# Altium project fNIRS_ECU.PrjPcb (part 3 of 3)
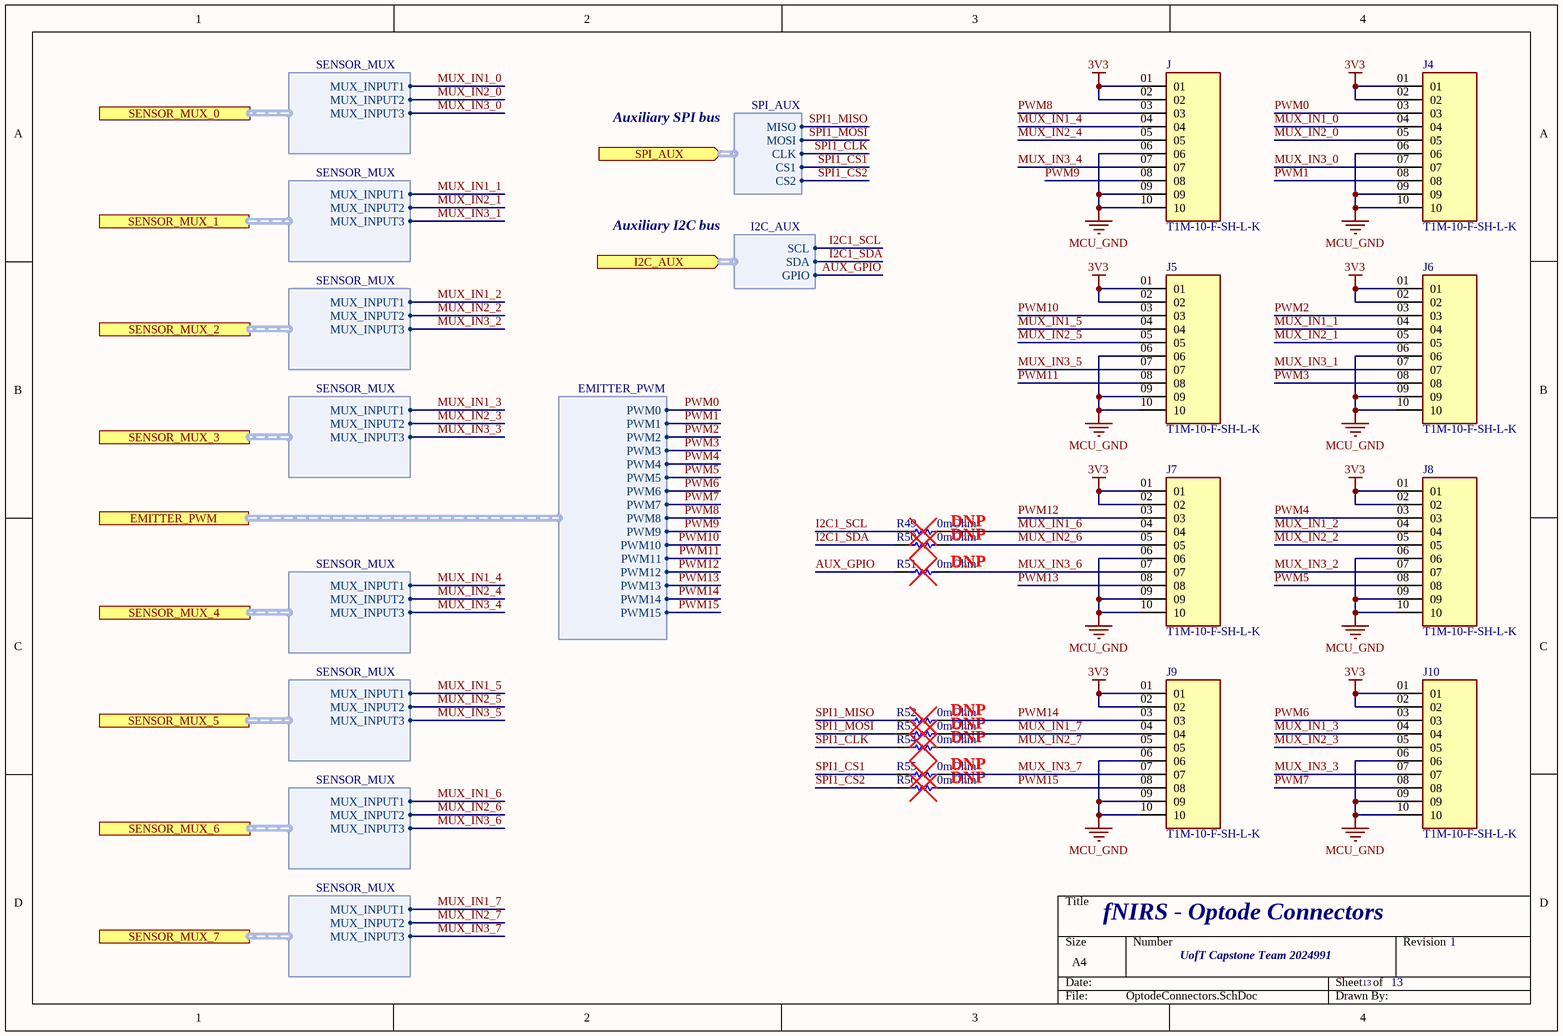
[diagram p13: OptodeConnectors.SchDoc]

## Nets that join several sheets
3V3: OptodeControl (6 pins), U_Sensing/U_AnalogMux (C21_U_Sensing_U_AnalogMux#1.1 U5_U_Sensing_U_AnalogMux#1.6), U_Sensing/U_AnalogMux (C21_U_Sensing_U_AnalogMux#2.1 U5_U_Sensing_U_AnalogMux#2.6), U_Sensing/U_AnalogMux (C21_U_Sensing_U_AnalogMux#3.1 U5_U_Sensing_U_AnalogMux#3.6), U_Sensing/U_AnalogMux (C21_U_Sensing_U_AnalogMux#4.1 U5_U_Sensing_U_AnalogMux#4.6), U_Sensing/U_AnalogMux (C21_U_Sensing_U_AnalogMux#5.1 U5_U_Sensing_U_AnalogMux#5.6), U_Sensing/U_AnalogMux (C21_U_Sensing_U_AnalogMux#6.1 U5_U_Sensing_U_AnalogMux#6.6), U_Sensing/U_AnalogMux (C21_U_Sensing_U_AnalogMux#7.1 U5_U_Sensing_U_AnalogMux#7.6), U_Sensing/U_AnalogMux (C21_U_Sensing_U_AnalogMux#8.1 U5_U_Sensing_U_AnalogMux#8.6), U_Sensing/U_Buffer (C22_U_Sensing_U_Buffer#1.2 U6_U_Sensing_U_Buffer#1.4), U_Sensing/U_Buffer (C22_U_Sensing_U_Buffer#2.2 U6_U_Sensing_U_Buffer#2.4), U_Sensing/U_Buffer (C22_U_Sensing_U_Buffer#3.2 U6_U_Sensing_U_Buffer#3.4), TemperatureSense (R41.2 R42.2 R45.2), Power (C18.1 U3.2 U3.4), MCU (17 pins), U_MCU/U_GPIO_Expander (5 pins), U_MCU/U_GPIO_Expander (5 pins), SD_Card (9 pins), USBInterface (5 pins), Connectors (J3.3), OptodeConnectors (16 pins)
5V_USB: Power (C15.1 U2.1), USBInterface (D2.4 U8.1), Connectors (J2.1)
MCU_GND: OptodeControl (9 pins), U_Sensing/U_AnalogMux (C21_U_Sensing_U_AnalogMux#1.2 U5_U_Sensing_U_AnalogMux#1.3), U_Sensing/U_AnalogMux (C21_U_Sensing_U_AnalogMux#2.2 U5_U_Sensing_U_AnalogMux#2.3), U_Sensing/U_AnalogMux (C21_U_Sensing_U_AnalogMux#3.2 U5_U_Sensing_U_AnalogMux#3.3), U_Sensing/U_AnalogMux (C21_U_Sensing_U_AnalogMux#4.2 U5_U_Sensing_U_AnalogMux#4.3), U_Sensing/U_AnalogMux (C21_U_Sensing_U_AnalogMux#5.2 U5_U_Sensing_U_AnalogMux#5.3), U_Sensing/U_AnalogMux (C21_U_Sensing_U_AnalogMux#6.2 U5_U_Sensing_U_AnalogMux#6.3), U_Sensing/U_AnalogMux (C21_U_Sensing_U_AnalogMux#7.2 U5_U_Sensing_U_AnalogMux#7.3), U_Sensing/U_AnalogMux (C21_U_Sensing_U_AnalogMux#8.2 U5_U_Sensing_U_AnalogMux#8.3), U_Sensing/U_Buffer (6 pins), U_Sensing/U_Buffer (6 pins), U_Sensing/U_Buffer (6 pins), TemperatureSense (6 pins), Power (11 pins), MCU (27 pins), U_MCU/U_GPIO_Expander (5 pins), U_MCU/U_GPIO_Expander (5 pins), SD_Card (12 pins), USBInterface (C29.2 U8.9 U8.15), Connectors (J3.5 J3.7), OptodeConnectors (24 pins)
USB_GND: Power (C15.2 U2.2 U2.3), USBInterface (C28.2 D2.1 U8.2 U8.8), Connectors (J2.5)
ADC12_IN6: U_Sensing/U_Buffer (C26_U_Sensing_U_Buffer#3.2 R19_U_Sensing_U_Buffer#3.2), MCU (U1.15)
ADC12_IN7: U_Sensing/U_Buffer (C25_U_Sensing_U_Buffer#3.2 R20_U_Sensing_U_Buffer#3.2), MCU (U1.16)
ADC12_IN8: U_Sensing/U_Buffer (C24_U_Sensing_U_Buffer#3.2 R21_U_Sensing_U_Buffer#3.2), MCU (U1.17)
ADC12_IN9: U_Sensing/U_Buffer (C23_U_Sensing_U_Buffer#3.2 R22_U_Sensing_U_Buffer#3.2), MCU (U1.20)
ADC12_IN12: U_Sensing/U_Buffer (C23_U_Sensing_U_Buffer#1.2 R22_U_Sensing_U_Buffer#1.2), MCU (U1.23)
ADC12_IN13: U_Sensing/U_Buffer (C24_U_Sensing_U_Buffer#1.2 R21_U_Sensing_U_Buffer#1.2), MCU (U1.24)
ADC12_IN14: U_Sensing/U_Buffer (C25_U_Sensing_U_Buffer#1.2 R20_U_Sensing_U_Buffer#1.2), MCU (U1.25)
ADC12_IN15: U_Sensing/U_Buffer (C26_U_Sensing_U_Buffer#1.2 R19_U_Sensing_U_Buffer#1.2), MCU (U1.26)
ADC123_IN1: U_Sensing/U_Buffer (C24_U_Sensing_U_Buffer#2.2 R21_U_Sensing_U_Buffer#2.2), MCU (U1.8)
ADC123_IN2: U_Sensing/U_Buffer (C23_U_Sensing_U_Buffer#2.2 R22_U_Sensing_U_Buffer#2.2), MCU (U1.9)
ADC123_IN3: U_Sensing/U_Buffer (C25_U_Sensing_U_Buffer#2.2 R20_U_Sensing_U_Buffer#2.2), MCU (U1.10)
ADC123_IN4: U_Sensing/U_Buffer (C26_U_Sensing_U_Buffer#2.2 R19_U_Sensing_U_Buffer#2.2), MCU (U1.11)
AMBIENT_TEMP: U_Sensing/U_Buffer (U6_U_Sensing_U_Buffer#3.12), TemperatureSense (C33.1 R45.1 R46.2)
AUX_GPIO: MCU (U1.33), OptodeConnectors (R51.2)
BATTERY_TEMP: U_Sensing/U_Buffer (U6_U_Sensing_U_Buffer#3.10), TemperatureSense (C31.1 R41.1 R43.2)
CARD_DETECT: MCU (U1.2), SD_Card (C14.1 R15.1 R17.2 SD1.9)
GPIO_EX1_P1_4: MCU (TP15.1), U_MCU/U_GPIO_Expander (U7_U_MCU_U_GPIO_Expander#2.17)
GPIO_EX1_P1_5: MCU (TP16.1), U_MCU/U_GPIO_Expander (U7_U_MCU_U_GPIO_Expander#2.18)
GPIO_EX1_P1_6: MCU (TP17.1), U_MCU/U_GPIO_Expander (U7_U_MCU_U_GPIO_Expander#2.19)
GPIO_EX1_P1_7: MCU (TP18.1), U_MCU/U_GPIO_Expander (U7_U_MCU_U_GPIO_Expander#2.20)
GPIO_EX2_P1_4: MCU (TP19.1), U_MCU/U_GPIO_Expander (U7_U_MCU_U_GPIO_Expander#1.17)
GPIO_EX2_P1_5: MCU (TP20.1), U_MCU/U_GPIO_Expander (U7_U_MCU_U_GPIO_Expander#1.18)
GPIO_EX2_P1_6: MCU (TP21.1), U_MCU/U_GPIO_Expander (U7_U_MCU_U_GPIO_Expander#1.19)
GPIO_EX2_P1_7: MCU (TP22.1), U_MCU/U_GPIO_Expander (U7_U_MCU_U_GPIO_Expander#1.20)
GPIO_P0_0: U_Sensing/U_AnalogMux (U5_U_Sensing_U_AnalogMux#2.1), U_MCU/U_GPIO_Expander (U7_U_MCU_U_GPIO_Expander#2.4)
GPIO_P0_0: U_Sensing/U_AnalogMux (U5_U_Sensing_U_AnalogMux#3.1), U_MCU/U_GPIO_Expander (U7_U_MCU_U_GPIO_Expander#1.4)
GPIO_P0_1: U_Sensing/U_AnalogMux (U5_U_Sensing_U_AnalogMux#2.10), U_MCU/U_GPIO_Expander (U7_U_MCU_U_GPIO_Expander#2.5)
GPIO_P0_1: U_Sensing/U_AnalogMux (U5_U_Sensing_U_AnalogMux#3.10), U_MCU/U_GPIO_Expander (U7_U_MCU_U_GPIO_Expander#1.5)
GPIO_P0_2: U_Sensing/U_AnalogMux (U5_U_Sensing_U_AnalogMux#2.5), U_MCU/U_GPIO_Expander (U7_U_MCU_U_GPIO_Expander#2.6)
GPIO_P0_2: U_Sensing/U_AnalogMux (U5_U_Sensing_U_AnalogMux#3.5), U_MCU/U_GPIO_Expander (U7_U_MCU_U_GPIO_Expander#1.6)
GPIO_P0_3: U_Sensing/U_AnalogMux (U5_U_Sensing_U_AnalogMux#6.1), U_MCU/U_GPIO_Expander (U7_U_MCU_U_GPIO_Expander#2.7)
GPIO_P0_3: U_Sensing/U_AnalogMux (U5_U_Sensing_U_AnalogMux#7.1), U_MCU/U_GPIO_Expander (U7_U_MCU_U_GPIO_Expander#1.7)
GPIO_P0_4: U_Sensing/U_AnalogMux (U5_U_Sensing_U_AnalogMux#6.10), U_MCU/U_GPIO_Expander (U7_U_MCU_U_GPIO_Expander#2.8)
GPIO_P0_4: U_Sensing/U_AnalogMux (U5_U_Sensing_U_AnalogMux#7.10), U_MCU/U_GPIO_Expander (U7_U_MCU_U_GPIO_Expander#1.8)
GPIO_P0_5: U_Sensing/U_AnalogMux (U5_U_Sensing_U_AnalogMux#6.5), U_MCU/U_GPIO_Expander (U7_U_MCU_U_GPIO_Expander#2.9)
GPIO_P0_5: U_Sensing/U_AnalogMux (U5_U_Sensing_U_AnalogMux#7.5), U_MCU/U_GPIO_Expander (U7_U_MCU_U_GPIO_Expander#1.9)
GPIO_P0_6: U_Sensing/U_AnalogMux (U5_U_Sensing_U_AnalogMux#4.1), U_MCU/U_GPIO_Expander (U7_U_MCU_U_GPIO_Expander#1.10)
GPIO_P0_6: U_Sensing/U_AnalogMux (U5_U_Sensing_U_AnalogMux#5.1), U_MCU/U_GPIO_Expander (U7_U_MCU_U_GPIO_Expander#2.10)
GPIO_P0_7: U_Sensing/U_AnalogMux (U5_U_Sensing_U_AnalogMux#4.10), U_MCU/U_GPIO_Expander (U7_U_MCU_U_GPIO_Expander#1.11)
GPIO_P0_7: U_Sensing/U_AnalogMux (U5_U_Sensing_U_AnalogMux#5.10), U_MCU/U_GPIO_Expander (U7_U_MCU_U_GPIO_Expander#2.11)
GPIO_P1_0: U_Sensing/U_AnalogMux (U5_U_Sensing_U_AnalogMux#4.5), U_MCU/U_GPIO_Expander (U7_U_MCU_U_GPIO_Expander#1.13)
GPIO_P1_0: U_Sensing/U_AnalogMux (U5_U_Sensing_U_AnalogMux#5.5), U_MCU/U_GPIO_Expander (U7_U_MCU_U_GPIO_Expander#2.13)
GPIO_P1_1: U_Sensing/U_AnalogMux (U5_U_Sensing_U_AnalogMux#1.1), U_MCU/U_GPIO_Expander (U7_U_MCU_U_GPIO_Expander#2.14)
GPIO_P1_1: U_Sensing/U_AnalogMux (U5_U_Sensing_U_AnalogMux#8.1), U_MCU/U_GPIO_Expander (U7_U_MCU_U_GPIO_Expander#1.14)
GPIO_P1_2: U_Sensing/U_AnalogMux (U5_U_Sensing_U_AnalogMux#1.10), U_MCU/U_GPIO_Expander (U7_U_MCU_U_GPIO_Expander#2.15)
GPIO_P1_2: U_Sensing/U_AnalogMux (U5_U_Sensing_U_AnalogMux#8.10), U_MCU/U_GPIO_Expander (U7_U_MCU_U_GPIO_Expander#1.15)
GPIO_P1_3: U_Sensing/U_AnalogMux (U5_U_Sensing_U_AnalogMux#1.5), U_MCU/U_GPIO_Expander (U7_U_MCU_U_GPIO_Expander#2.16)
GPIO_P1_3: U_Sensing/U_AnalogMux (U5_U_Sensing_U_AnalogMux#8.5), U_MCU/U_GPIO_Expander (U7_U_MCU_U_GPIO_Expander#1.16)
I2C1_SCL: MCU (R2.1 TP2.1 U1.61), U_MCU/U_GPIO_Expander (U7_U_MCU_U_GPIO_Expander#1.22), U_MCU/U_GPIO_Expander (U7_U_MCU_U_GPIO_Expander#2.22), OptodeConnectors (R49.2)
I2C1_SDA: MCU (R1.1 TP6.1 U1.62), U_MCU/U_GPIO_Expander (U7_U_MCU_U_GPIO_Expander#1.23), U_MCU/U_GPIO_Expander (U7_U_MCU_U_GPIO_Expander#2.23), OptodeConnectors (R50.2)
I2C2_SCL: OptodeControl (U9.26), MCU (R4.1 TP3.1 U1.34)
I2C2_SDA: OptodeControl (U9.27), MCU (R3.1 TP7.1 U1.35)
INA: Sensing (TP9.1), U_Sensing/U_Buffer (U6_U_Sensing_U_Buffer#3.3)
INA: U_Sensing/U_AnalogMux (U5_U_Sensing_U_AnalogMux#1.8), U_Sensing/U_Buffer (U6_U_Sensing_U_Buffer#1.3)
INA: U_Sensing/U_AnalogMux (U5_U_Sensing_U_AnalogMux#3.8), U_Sensing/U_Buffer (U6_U_Sensing_U_Buffer#2.3)
INB: U_Sensing/U_AnalogMux (U5_U_Sensing_U_AnalogMux#5.8), U_Sensing/U_Buffer (U6_U_Sensing_U_Buffer#1.5)
INB: U_Sensing/U_AnalogMux (U5_U_Sensing_U_AnalogMux#7.8), U_Sensing/U_Buffer (U6_U_Sensing_U_Buffer#2.5)
INB: U_Sensing/U_Buffer (U6_U_Sensing_U_Buffer#3.5), TemperatureSense (C32.1 R42.1 R44.2)
INC: U_Sensing/U_AnalogMux (U5_U_Sensing_U_AnalogMux#2.8), U_Sensing/U_Buffer (U6_U_Sensing_U_Buffer#1.10)
INC: U_Sensing/U_AnalogMux (U5_U_Sensing_U_AnalogMux#4.8), U_Sensing/U_Buffer (U6_U_Sensing_U_Buffer#2.10)
IND: U_Sensing/U_AnalogMux (U5_U_Sensing_U_AnalogMux#6.8), U_Sensing/U_Buffer (U6_U_Sensing_U_Buffer#1.12)
IND: U_Sensing/U_AnalogMux (U5_U_Sensing_U_AnalogMux#8.8), U_Sensing/U_Buffer (U6_U_Sensing_U_Buffer#2.12)
MUX_IN1_0: U_Sensing/U_AnalogMux (U5_U_Sensing_U_AnalogMux#1.2), OptodeConnectors (J4.04)
MUX_IN1_1: U_Sensing/U_AnalogMux (U5_U_Sensing_U_AnalogMux#5.2), OptodeConnectors (J6.04)
MUX_IN1_2: U_Sensing/U_AnalogMux (U5_U_Sensing_U_AnalogMux#2.2), OptodeConnectors (J8.04)
MUX_IN1_3: U_Sensing/U_AnalogMux (U5_U_Sensing_U_AnalogMux#6.2), OptodeConnectors (J10.04)
MUX_IN1_4: U_Sensing/U_AnalogMux (U5_U_Sensing_U_AnalogMux#3.2), OptodeConnectors (J.04)
MUX_IN1_5: U_Sensing/U_AnalogMux (U5_U_Sensing_U_AnalogMux#7.2), OptodeConnectors (J5.04)
MUX_IN1_6: U_Sensing/U_AnalogMux (U5_U_Sensing_U_AnalogMux#4.2), OptodeConnectors (J7.04 R49.1)
MUX_IN1_7: U_Sensing/U_AnalogMux (U5_U_Sensing_U_AnalogMux#8.2), OptodeConnectors (J9.04 R53.1)
MUX_IN2_0: U_Sensing/U_AnalogMux (U5_U_Sensing_U_AnalogMux#1.9), OptodeConnectors (J4.05)
MUX_IN2_1: U_Sensing/U_AnalogMux (U5_U_Sensing_U_AnalogMux#5.9), OptodeConnectors (J6.05)
MUX_IN2_2: U_Sensing/U_AnalogMux (U5_U_Sensing_U_AnalogMux#2.9), OptodeConnectors (J8.05)
MUX_IN2_3: U_Sensing/U_AnalogMux (U5_U_Sensing_U_AnalogMux#6.9), OptodeConnectors (J10.05)
MUX_IN2_4: U_Sensing/U_AnalogMux (U5_U_Sensing_U_AnalogMux#3.9), OptodeConnectors (J.05)
MUX_IN2_5: U_Sensing/U_AnalogMux (U5_U_Sensing_U_AnalogMux#7.9), OptodeConnectors (J5.05)
MUX_IN2_6: U_Sensing/U_AnalogMux (U5_U_Sensing_U_AnalogMux#4.9), OptodeConnectors (J7.05 R50.1)
MUX_IN2_7: U_Sensing/U_AnalogMux (U5_U_Sensing_U_AnalogMux#8.9), OptodeConnectors (J9.05 R54.1)
MUX_IN3_0: U_Sensing/U_AnalogMux (U5_U_Sensing_U_AnalogMux#1.4), OptodeConnectors (J4.07)
MUX_IN3_1: U_Sensing/U_AnalogMux (U5_U_Sensing_U_AnalogMux#5.4), OptodeConnectors (J6.07)
MUX_IN3_2: U_Sensing/U_AnalogMux (U5_U_Sensing_U_AnalogMux#2.4), OptodeConnectors (J8.07)
MUX_IN3_3: U_Sensing/U_AnalogMux (U5_U_Sensing_U_AnalogMux#6.4), OptodeConnectors (J10.07)
MUX_IN3_4: U_Sensing/U_AnalogMux (U5_U_Sensing_U_AnalogMux#3.4), OptodeConnectors (J.07)
MUX_IN3_5: U_Sensing/U_AnalogMux (U5_U_Sensing_U_AnalogMux#7.4), OptodeConnectors (J5.07)
MUX_IN3_6: U_Sensing/U_AnalogMux (U5_U_Sensing_U_AnalogMux#4.4), OptodeConnectors (J7.07 R51.1)
MUX_IN3_7: U_Sensing/U_AnalogMux (U5_U_Sensing_U_AnalogMux#8.4), OptodeConnectors (J9.07 R55.1)
NRST: MCU (C1.1 SW1.1 SW1.2 U1.7), Connectors (J3.12)
PWM0: OptodeControl (U9.6), OptodeConnectors (J4.03)
PWM1: OptodeControl (U9.7), OptodeConnectors (J4.08)
PWM2: OptodeControl (U9.8), OptodeConnectors (J6.03)
PWM3: OptodeControl (U9.9), OptodeConnectors (J6.08)
PWM4: OptodeControl (U9.10), OptodeConnectors (J8.03)
PWM5: OptodeControl (U9.11), OptodeConnectors (J8.08)
PWM6: OptodeControl (U9.12), OptodeConnectors (J10.03)
PWM7: OptodeControl (U9.13), OptodeConnectors (J10.08)
PWM8: OptodeControl (U9.15), OptodeConnectors (J.03)
PWM9: OptodeControl (U9.16), OptodeConnectors (J.08)
PWM10: OptodeControl (U9.17), OptodeConnectors (J5.03)
PWM11: OptodeControl (U9.18), OptodeConnectors (J5.08)
PWM12: OptodeControl (U9.19), OptodeConnectors (J7.03)
PWM13: OptodeControl (U9.20), OptodeConnectors (J7.08)
PWM14: OptodeControl (U9.21), OptodeConnectors (J9.03 R52.1)
PWM15: OptodeControl (U9.22), OptodeConnectors (J9.08 R56.1)
PWM_CTRL_EN1: OptodeControl (U9.23), MCU (TP4.1 U1.38)
SDMMC1_CK: MCU (U1.53), SD_Card (SD1.5)
SDMMC1_CMD: MCU (U1.54), SD_Card (R11.1 SD1.3)
SDMMC1_D0: MCU (U1.39), SD_Card (R12.1 SD1.7)
SDMMC1_D1: MCU (U1.40), SD_Card (R13.1 SD1.8)
SDMMC1_D2: MCU (U1.51), SD_Card (R9.1 SD1.1)
SDMMC1_D3: MCU (U1.52), SD_Card (R10.1 SD1.2)
SPI1_CLK: MCU (U1.55), OptodeConnectors (R54.2)
SPI1_CS1: MCU (U1.42), OptodeConnectors (R55.2)
SPI1_CS2: MCU (U1.43), OptodeConnectors (R56.2)
SPI1_MISO: MCU (U1.56), OptodeConnectors (R52.2)
SPI1_MOSI: MCU (U1.57), OptodeConnectors (R53.2)
SWCLK: MCU (U1.49), Connectors (J3.6)
SWDIO: MCU (U1.46), Connectors (J3.4)
USART1_RX: MCU (U1.59), Connectors (J3.13)
USART1_TX: MCU (U1.58), Connectors (J3.14)
USB_D_N: USBInterface (D2.2 R31.1), Connectors (J2.2)
USB_D_P: USBInterface (D2.3 R29.1), Connectors (J2.3)
USB_OTG_FS_D_N: MCU (U1.44), USBInterface (R32.2 TP13.1)
USB_OTG_FS_D_P: MCU (U1.45), USBInterface (R30.2 TP11.1)